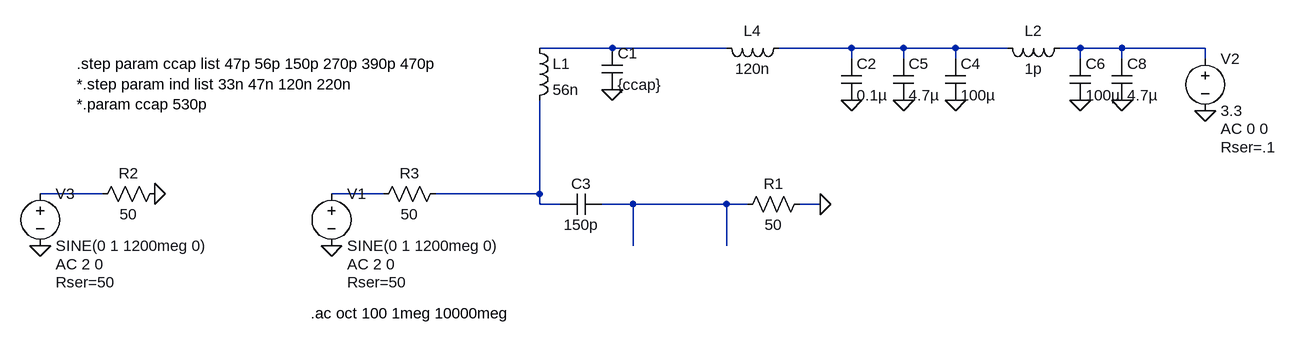
[diagram p0: schematic ACTIVE ANTENNA.asc]
ACTIVE ANTENNA.asc, the LTspice schematic file:
Version 4
SHEET 1 1484 680
WIRE 448 -64 336 -64
WIRE 624 -64 448 -64
WIRE 816 -64 704 -64
WIRE 896 -64 816 -64
WIRE 976 -64 896 -64
WIRE 1056 -64 976 -64
WIRE 1168 -64 1136 -64
WIRE 1232 -64 1168 -64
WIRE 1360 -64 1232 -64
WIRE 816 -48 816 -64
WIRE 896 -48 896 -64
WIRE 976 -48 976 -64
WIRE 1168 -48 1168 -64
WIRE 1232 -48 1232 -64
WIRE 1360 -48 1360 -64
WIRE -336 160 -432 160
WIRE 96 160 16 160
WIRE 336 160 336 16
WIRE 336 160 176 160
WIRE 336 176 336 160
WIRE 368 176 336 176
WIRE 480 176 432 176
WIRE 624 176 480 176
WIRE 656 176 624 176
WIRE 768 176 736 176
WIRE 480 240 480 176
WIRE 624 240 624 176
FLAG 16 240 0
FLAG 816 16 0
FLAG 448 0 0
FLAG 896 16 0
FLAG 1360 32 0
FLAG 768 176 0
FLAG -256 160 0
FLAG -432 240 0
FLAG 976 16 0
FLAG 1168 16 0
FLAG 1232 16 0
SYMBOL voltage 16 144 R0
WINDOW 123 24 124 Left 2
WINDOW 39 24 152 Left 2
SYMATTR Value2 AC 2 0
SYMATTR SpiceLine Rser=50
SYMATTR InstName V1
SYMATTR Value SINE(0 1 1200meg 0)
SYMBOL ind 320 -80 R0
SYMATTR InstName L1
SYMATTR Value 56n
SYMATTR SpiceLine Ipk=0.45 Rser=0.4 Rpar=2563 Cpar=0.17p
SYMBOL cap 432 -64 R0
SYMATTR InstName C1
SYMATTR Value {ccap}
SYMATTR SpiceLine V=6.3 Irms=8.6m Rser=9.56706 Lser=0 mfg="KEMET" pn="C0402C331K9RAC" type="X7R"
SYMBOL ind 720 -80 R90
WINDOW 0 5 56 VBottom 2
WINDOW 3 32 56 VTop 2
SYMATTR InstName L4
SYMATTR Value 120n
SYMBOL cap 432 160 R90
WINDOW 0 0 32 VBottom 2
WINDOW 3 32 32 VTop 2
SYMATTR InstName C3
SYMATTR Value 150p
SYMBOL voltage 1360 -64 R0
WINDOW 123 24 124 Left 2
WINDOW 39 24 152 Left 2
SYMATTR Value2 AC 0 0
SYMATTR SpiceLine Rser=.1
SYMATTR InstName V2
SYMATTR Value 3.3
SYMBOL res 752 160 R90
WINDOW 0 0 56 VBottom 2
WINDOW 3 32 56 VTop 2
SYMATTR InstName R1
SYMATTR Value 50
SYMBOL voltage -432 144 R0
WINDOW 123 24 124 Left 2
WINDOW 39 24 152 Left 2
SYMATTR Value2 AC 2 0
SYMATTR SpiceLine Rser=50
SYMATTR InstName V3
SYMATTR Value SINE(0 1 1200meg 0)
SYMBOL res -240 144 R90
WINDOW 0 0 56 VBottom 2
WINDOW 3 32 56 VTop 2
SYMATTR InstName R2
SYMATTR Value 50
SYMBOL cap 800 -48 R0
SYMATTR InstName C2
SYMATTR Value 0.1µ
SYMATTR SpiceLine V=50 Irms=835m Rser=0.0936732 Lser=0 mfg="KEMET" pn="C1812C104K5RAC" type="X7R"
SYMBOL cap 1152 -48 R0
SYMATTR InstName C6
SYMATTR Value 100µ
SYMATTR SpiceLine V=35 Irms=.3 Rser=.26
SYMBOL cap 1216 -48 R0
SYMATTR InstName C8
SYMATTR Value 4.7µ
SYMATTR SpiceLine V=16 Irms=11 Rser=0.00897799 Lser=0 mfg="KEMET" pn="C1210C475K4RAC" type="X7R"
SYMBOL ind 1152 -80 R90
WINDOW 0 5 56 VBottom 2
WINDOW 3 32 56 VTop 2
SYMATTR InstName L2
SYMATTR Value 1p
SYMBOL cap 960 -48 R0
SYMATTR InstName C4
SYMATTR Value 100µ
SYMATTR SpiceLine V=35 Irms=.3 Rser=.26
SYMBOL cap 880 -48 R0
SYMATTR InstName C5
SYMATTR Value 4.7µ
SYMATTR SpiceLine V=16 Irms=11 Rser=0.00897799 Lser=0 mfg="KEMET" pn="C1210C475K4RAC" type="X7R"
SYMBOL res 192 144 R90
WINDOW 0 0 56 VBottom 2
WINDOW 3 32 56 VTop 2
SYMATTR InstName R3
SYMATTR Value 50
TEXT -16 344 Left 2 !.ac oct 100 1meg 10000meg
TEXT -376 -40 Left 2 !.step param ccap list 47p 56p 150p 270p 390p 470p\n*.step param ind list 33n 47n 120n 220n\n*.param ccap 530p

The netlist it stands for:
* ACTIVE ANTENNA.asc
V1 N005 0 SINE(0 1 1200meg 0) AC 2 0 Rser=50
L1 N001 N006 56n Ipk=0.45 Rser=0.4 Rpar=2563 Cpar=0.17p
C1 N001 0 {ccap} V=6.3 Irms=8.6m Rser=9.56706 Lser=0 mfg="KEMET" pn="C0402C331K9RAC" type="X7R"
L4 N002 N001 120n
C3 N007 N006 150p
V2 N003 0 3.3 AC 0 0 Rser=.1
R1 0 N007 50
V3 N004 0 SINE(0 1 1200meg 0) AC 2 0 Rser=50
R2 0 N004 50
C2 N002 0 0.1µ V=50 Irms=835m Rser=0.0936732 Lser=0 mfg="KEMET" pn="C1812C104K5RAC" type="X7R"
C6 N003 0 100µ V=35 Irms=.3 Rser=.26
C8 N003 0 4.7µ V=16 Irms=11 Rser=0.00897799 Lser=0 mfg="KEMET" pn="C1210C475K4RAC" type="X7R"
L2 N003 N002 1p
C4 N002 0 100µ V=35 Irms=.3 Rser=.26
C5 N002 0 4.7µ V=16 Irms=11 Rser=0.00897799 Lser=0 mfg="KEMET" pn="C1210C475K4RAC" type="X7R"
R3 N006 N005 50
.ac oct 100 1meg 10000meg
.step param ccap list 47p 56p 150p 270p 390p 470p
*.step param ind list 33n 47n 120n 220n
*.param ccap 530p
.backanno
.end